# EasyEDA Pro project OSC1.eprj, schematic ADC+主板
Create Date: 2024-10-10; Page Name: ADC+主板; Project Name: OSC1; Schematic Name: ADC+主板; Update Date: 2025-06-11; Company: 嘉立创EDA; Page Size: A4; Version: V1.0
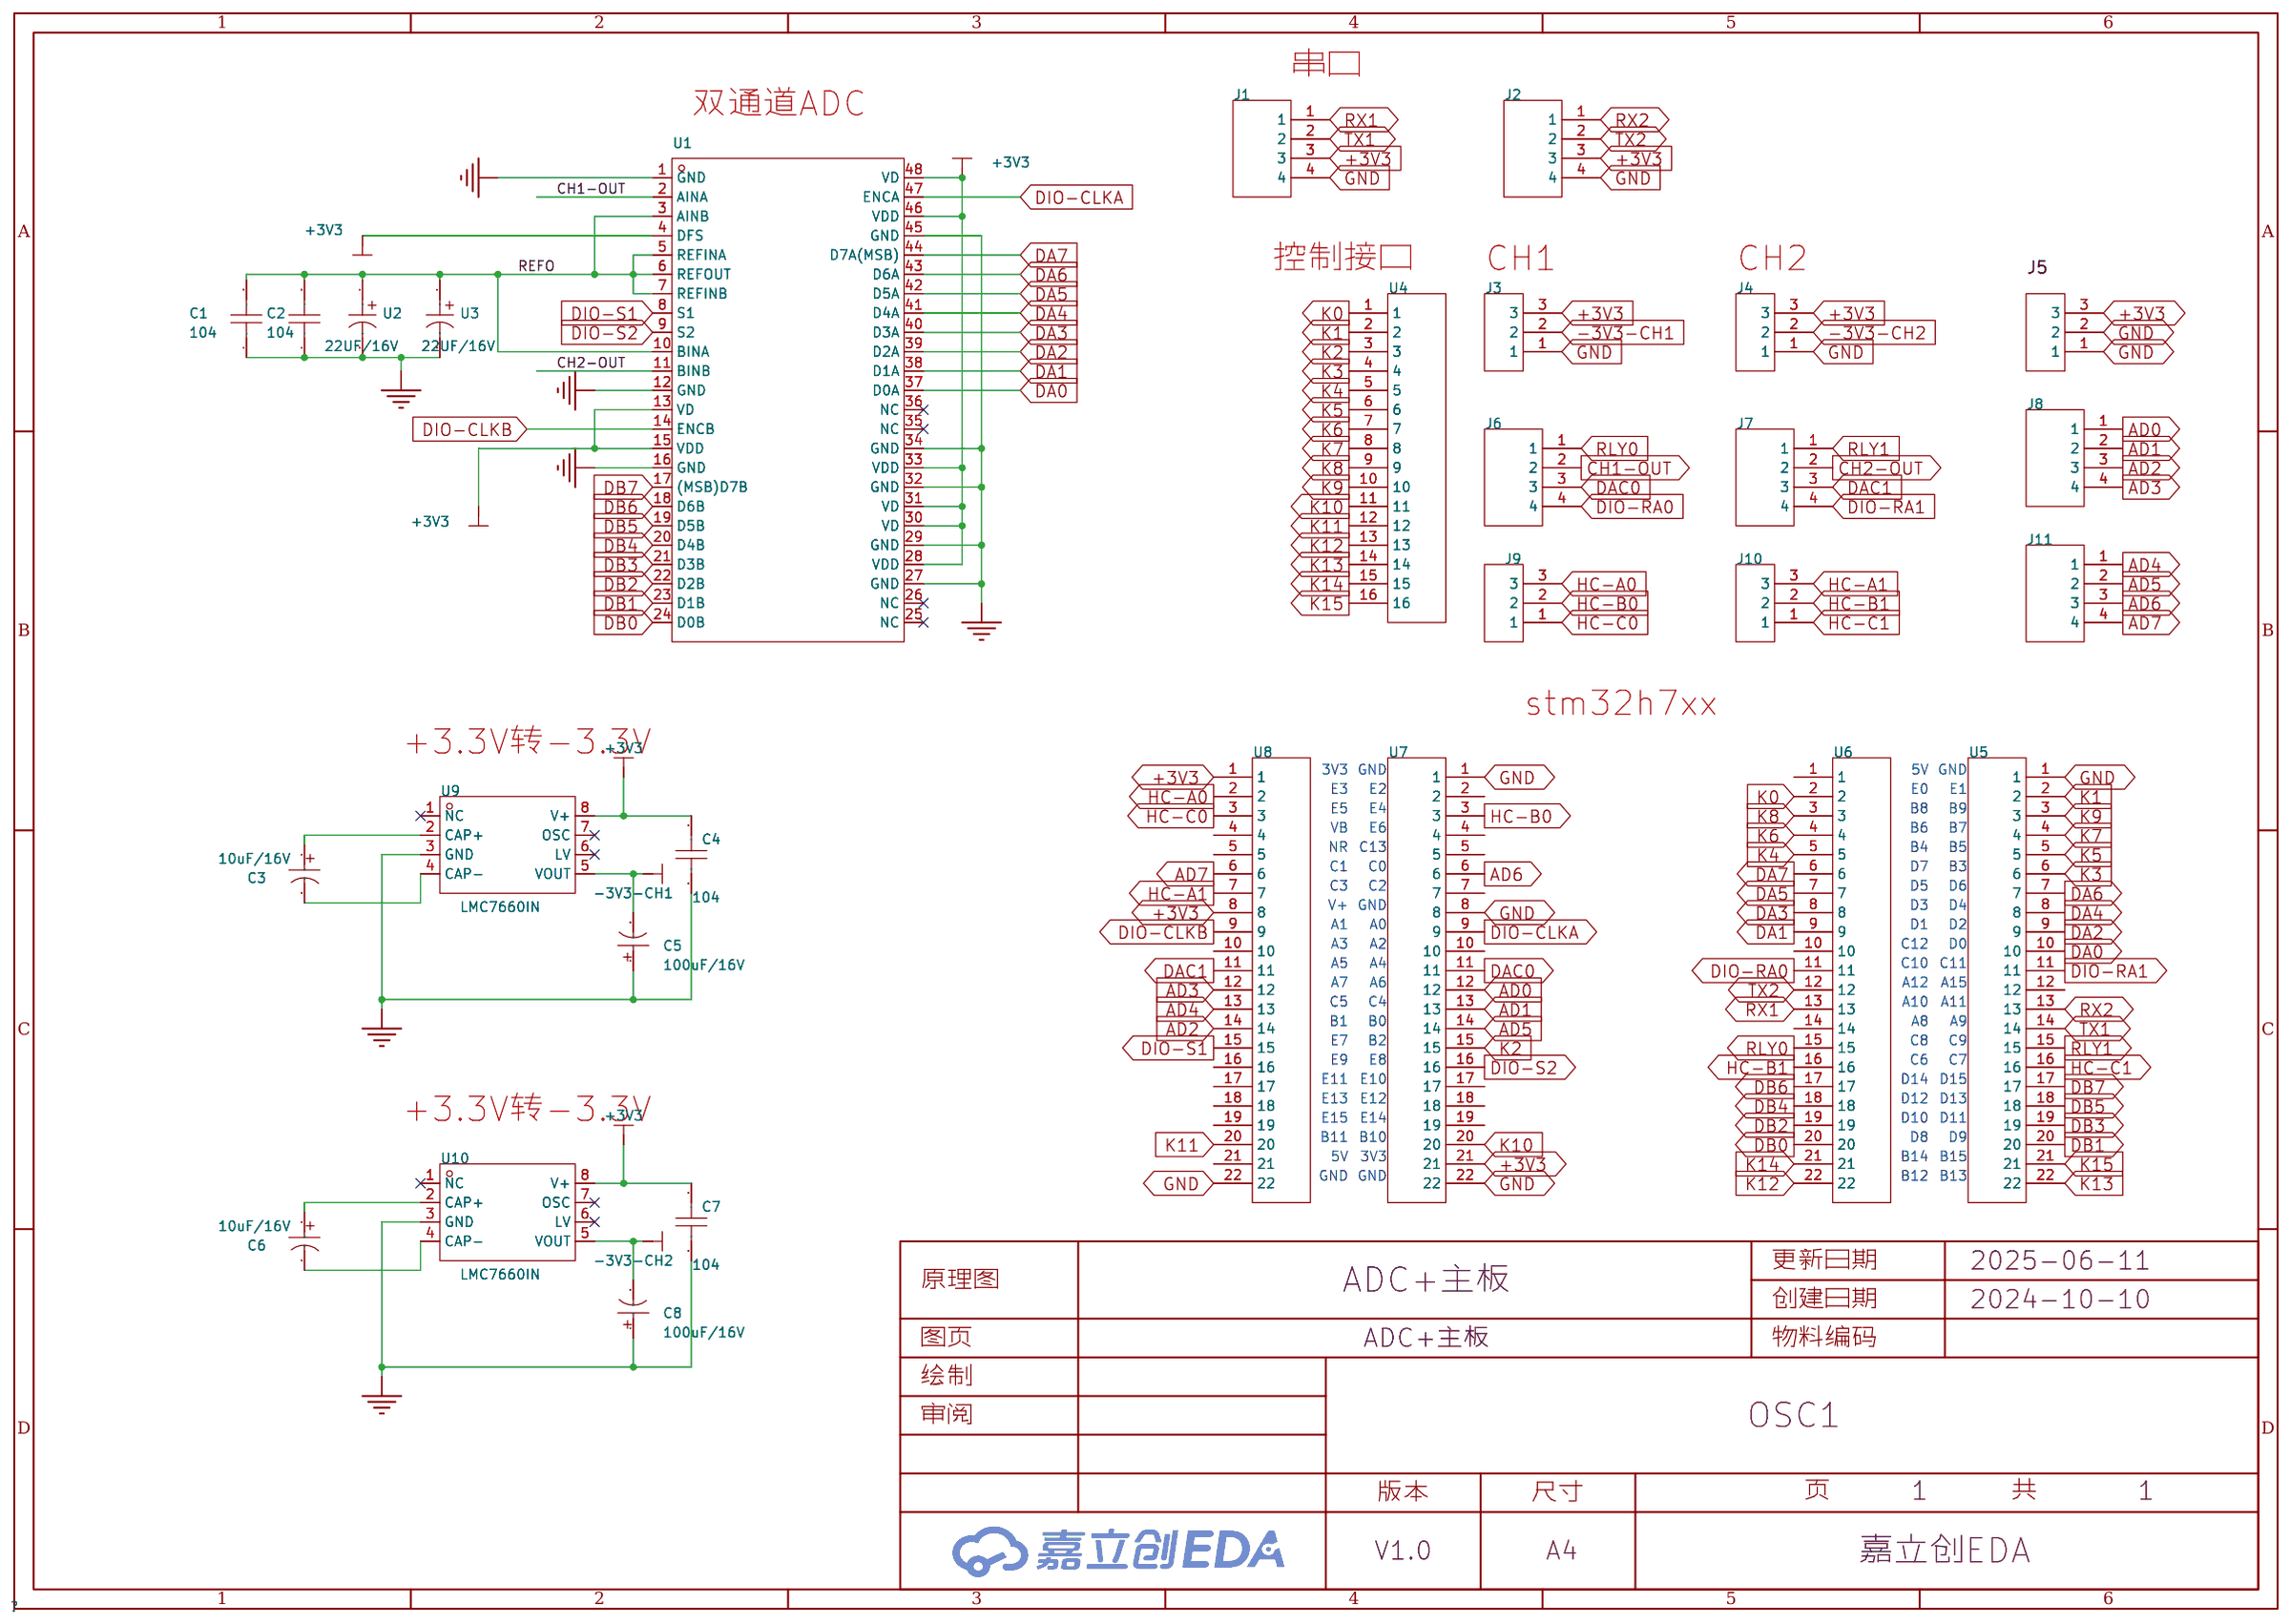
[diagram p0: schematic sheet]

## Parts
C1  104  [280*100mil]
C2  104  [280*100mil]
C3  10uF/16V  [CAP-TH_BD5.0-P2.00-D0.5-FD-A]
C4  104  [280*100mil]
C5  100uF/16V  [CAP-TH_BD6.3-P2.50-D0.5-FD]
C6  10uF/16V  [CAP-TH_BD5.0-P2.00-D0.5-FD-A]
C7  104  [280*100mil]
C8  100uF/16V  [CAP-TH_BD6.3-P2.50-D0.5-FD]
J1  -  [CH2.54-4插座]
J2  -  [CH2.54-4插座]
J3  -  [CH2.54-3插座]
J4  -  [CH2.54-3插座]
J5  -  [CH2.54-3插座]
J6  -  [CH2.54-4插座]
J7  -  [CH2.54-4插座]
J8  -  [CH2.54-4插座]
J9  -  [CH2.54-3插座]
J10  -  [CH2.54-3插座]
J11  -  [CH2.54-4插座]
U1  AD9288  [LQFP-48_L7.0-W7.0-P0.50-LS9.0-TL]
U2  22UF/16V  [CAP-TH_BD5.0-P2.00-D0.5-FD-A]
U3  22UF/16V  [CAP-TH_BD5.0-P2.00-D0.5-FD-A]
U4  -  [CH2.54-16P]
U5  -  [CH2.54-22P]
U6  -  [CH2.54-22P]
U7  -  [CH2.54-22P]
U8  -  [CH2.54-22P]
U9  LMC7660IN  [PDIP-8_L9.6-W6.4-P2.54-LS7.6-BL]
U10  LMC7660IN  [PDIP-8_L9.6-W6.4-P2.54-LS7.6-BL]

## Library data of the parts
C1 C2 = 插件电容
C3 C6 = RVT1C100M0405: 容值:10uF;精度:±20%;额定电压:16V;纹波电流:-;等效串联电阻:-;; LCSC Part Name: 10uF ±20% 16V; Supplier Part: C3357; Manufacturer: HONOR(荣誉); Supplier Footprint: SMD,D4xL5.4mm; JLCPCB Part Class: 扩展库; Datasheet: https://atta.szlcsc.com/upload/public/pdf/source/20210521/C113284_25C86AE95FB541053FE695F13EA8E7D0.pdf; Supplier: LCSC; Tolerance: ±20%; Rated Voltage: 16V; φD: 4mm; L: 5.4mm; Lifetime @ Temp: 2000hrs@105℃; Operating Temperature: -55℃~+105℃
C4 C7 = CL05B104KB54PNC: 容值:100nF;精度:±10%;额定电压:50V;材质(温度系数):X7R;; LCSC Part Name: 100nF ±10% 50V; Supplier Part: C307331; Manufacturer: SAMSUNG(三星); Supplier Footprint: 0402; JLCPCB Part Class: 基础库; Datasheet: https://atta.szlcsc.com/upload/public/pdf/source/20160218/1457707763339.pdf; Supplier: LCSC; Tolerance: ±10%; Voltage Rated: 50V; Temperature Coefficient: X7R
C5 C8 = RVT1C101M0605: 容值:100uF;精度:±20%;额定电压:16V;纹波电流:-;等效串联电阻:-;; LCSC Part Name: 100uF ±20% 16V; Supplier Part: C37308; Manufacturer: HONOR(荣誉); Supplier Footprint: SMD,D6.3xL5.4mm; JLCPCB Part Class: 扩展库; Datasheet: https://atta.szlcsc.com/upload/public/pdf/source/20210521/C113284_25C86AE95FB541053FE695F13EA8E7D0.pdf; Supplier: LCSC; Tolerance: ±20%; Rated Voltage: 16V; φD: 6.3mm; L: 5.4mm; Lifetime @ Temp: 2000hrs@105℃; Operating Temperature: -55℃~+105℃
J1 J2 J6-J8 J11 = HDR-4P
J3-J5 J9 J10 = HDR-3P
U1 = MXT2088: Supplier Part: C9900042531; Supplier Footprint: LQFP48; Supplier: LCSC
U2 U3 = 有极性电容: LCSC Part Name: TCAP_SMT_10U; Supplier Part: C9900021659; Supplier Footprint: 钽电容1206; Supplier: LCSC
U4 = HDR-16P
U5-U8 = HDR-22P
U9 U10 = LMC7660IN/NOPB: 功能类型:-;输出类型:固定;输入电压:1.5V~10V;输出电流(最大值):-;; Supplier Part: C1355708; Manufacturer: TI(德州仪器); Supplier Footprint: PDIP-8; JLCPCB Part Class: 扩展库; Datasheet: https://www.ti.com/cn/lit/gpn/lmc7660; Supplier: LCSC; Output Type: 固定; Input Voltage: 1.5V~10V; Switching Frequency: 10kHz; Synchronous Rectification: 否; Number of Outputs: 1; Switch tube (built-in/external): 内置

## Nets
+3V3: C4.1 C7.1 J1.3 J2.3 J3.3 J4.3 J5.3 U1.4(DFS) U1.13(VD) U1.15(VDD) U1.28(VDD) U1.30(VD) U1.31(VD) U1.33(VDD) U1.46(VDD) U1.48(VD) U7.21 U8.1 U8.8 U9.8(V+) U10.8(V+)
-3V3-CH1: C5.2 J3.2 U9.5(VOUT)
-3V3-CH2: C8.2 J4.2 U10.5(VOUT)
GND: C1.1 C2.1 C4.2 C5.1 C7.2 C8.1 J1.4 J2.4 J3.1 J4.1 J5.1 J5.2 U1.1(GND) U1.12(GND) U1.16(GND) U1.27(GND) U1.29(GND) U1.32(GND) U1.34(GND) U1.45(GND) U2.2 U3.2 U5.1 U7.1 U7.8 U7.22 U8.22 U9.3(GND) U10.3(GND)
AD0: J8.1 U7.12
AD1: J8.2 U7.13
AD2: J8.3 U8.14
AD3: J8.4 U8.12
AD4: J11.1 U8.13
AD5: J11.2 U7.14
AD6: J11.3 U7.6
AD7: J11.4 U8.6
CH1-OUT: J6.2 U1.2(AINA)
CH2-OUT: J7.2 U1.11(BINB)
DA0: U1.37(D0A) U5.10
DA1: U1.38(D1A) U6.9
DA2: U1.39(D2A) U5.9
DA3: U1.40(D3A) U6.8
DA4: U1.41(D4A) U5.8
DA5: U1.42(D5A) U6.7
DA6: U1.43(D6A) U5.7
DA7: U1.44(D7A(MSB)) U6.6
DAC0: J6.3 U7.11
DAC1: J7.3 U8.11
DB0: U1.24(D0B) U6.20
DB1: U1.23(D1B) U5.20
DB2: U1.22(D2B) U6.19
DB3: U1.21(D3B) U5.19
DB4: U1.20(D4B) U6.18
DB5: U1.19(D5B) U5.18
DB6: U1.18(D6B) U6.17
DB7: U1.17((MSB)D7B) U5.17
DIO-CLKA: U1.47(ENCA) U7.9
DIO-CLKB: U1.14(ENCB) U8.9
DIO-RA0: J6.4 U6.11
DIO-RA1: J7.4 U5.11
DIO-S1: U1.8(S1) U8.15
DIO-S2: U1.9(S2) U7.16
HC-A0: J9.3 U8.2
HC-A1: J10.3 U8.7
HC-B0: J9.2 U7.3
HC-B1: J10.2 U6.16
HC-C0: J9.1 U8.3
HC-C1: J10.1 U5.16
K0: U4.1 U6.2
K1: U4.2 U5.2
K2: U4.3 U7.15
K3: U4.4 U5.6
K4: U4.5 U6.5
K5: U4.6 U5.5
K6: U4.7 U6.4
K7: U4.8 U5.4
K8: U4.9 U6.3
K9: U4.10 U5.3
K10: U4.11 U7.20
K11: U4.12 U8.20
K12: U4.13 U6.22
K13: U4.14 U5.22
K14: U4.15 U6.21
K15: U4.16 U5.21
REFO: C1.2 C2.2 U1.3(AINB) U1.5(REFINA) U1.6(REFOUT) U1.7(REFINB) U1.10(BINA) U2.1 U3.1
RLY0: J6.1 U6.15
RLY1: J7.1 U5.15
RX1: J1.1 U6.13
RX2: J2.1 U5.13
TX1: J1.2 U5.14
TX2: J2.2 U6.12
$1N2683: C3.1 U9.2(CAP+)
$1N2685: C3.2 U9.4(CAP-)
$1N11061: C6.1 U10.2(CAP+)
$1N11063: C6.2 U10.4(CAP-)

Not connected (* = marked no-connect by the designer): U1 25(NC)* 26(NC)* 35(NC)* 36(NC)*; U5 12; U6 1 10 14; U7 2 4 5 7 10 17 18 19; U8 4 5 10 16 17 18 19 21; U9 1(NC)* 6(LV)* 7(OSC)*; U10 1(NC)* 6(LV)* 7(OSC)*

## Notes on the sheet
- 串口
- 双通道ADC
- 控制接口
- CH1
- CH2
- stm32h7xx
- +3.3V转-3.3V
- 3V3
- GND
- 5V
- GND
- E3
- E2
- E0
- E1
- E5
- E4
- B8
- B9
- VB
- E6
- B6
- B7
- NR
- C13
- B4
- B5
- C1
- C0
- D7
- B3
- C3
- V+
- C2
- GND
- D3
- D5
- D4
- D6
- A1
- A0
- D1
- D2
- A3
- A2
- C12
- D0
- A5
- A4
- C10
- C11
- A7
- A6
- A12
- A15
- B1
- C5
- B0
- C4
- A10
- A8
- A11
- A9
- E7
- B2
- C8
- C9
- E9
- E8
- C6
- C7
- E11
- E10
- D14
- D15
- E13
- E12
- D12
- D13
- +3.3V转-3.3V
- E15
- E14
- D10
- D11
- 5V
- B11
- 3V3
- B10
- B14
- D8
- B15
- D9
- GND
- GND
- B12
- B13
